# Altium project GEX_Zero.PrjPcb
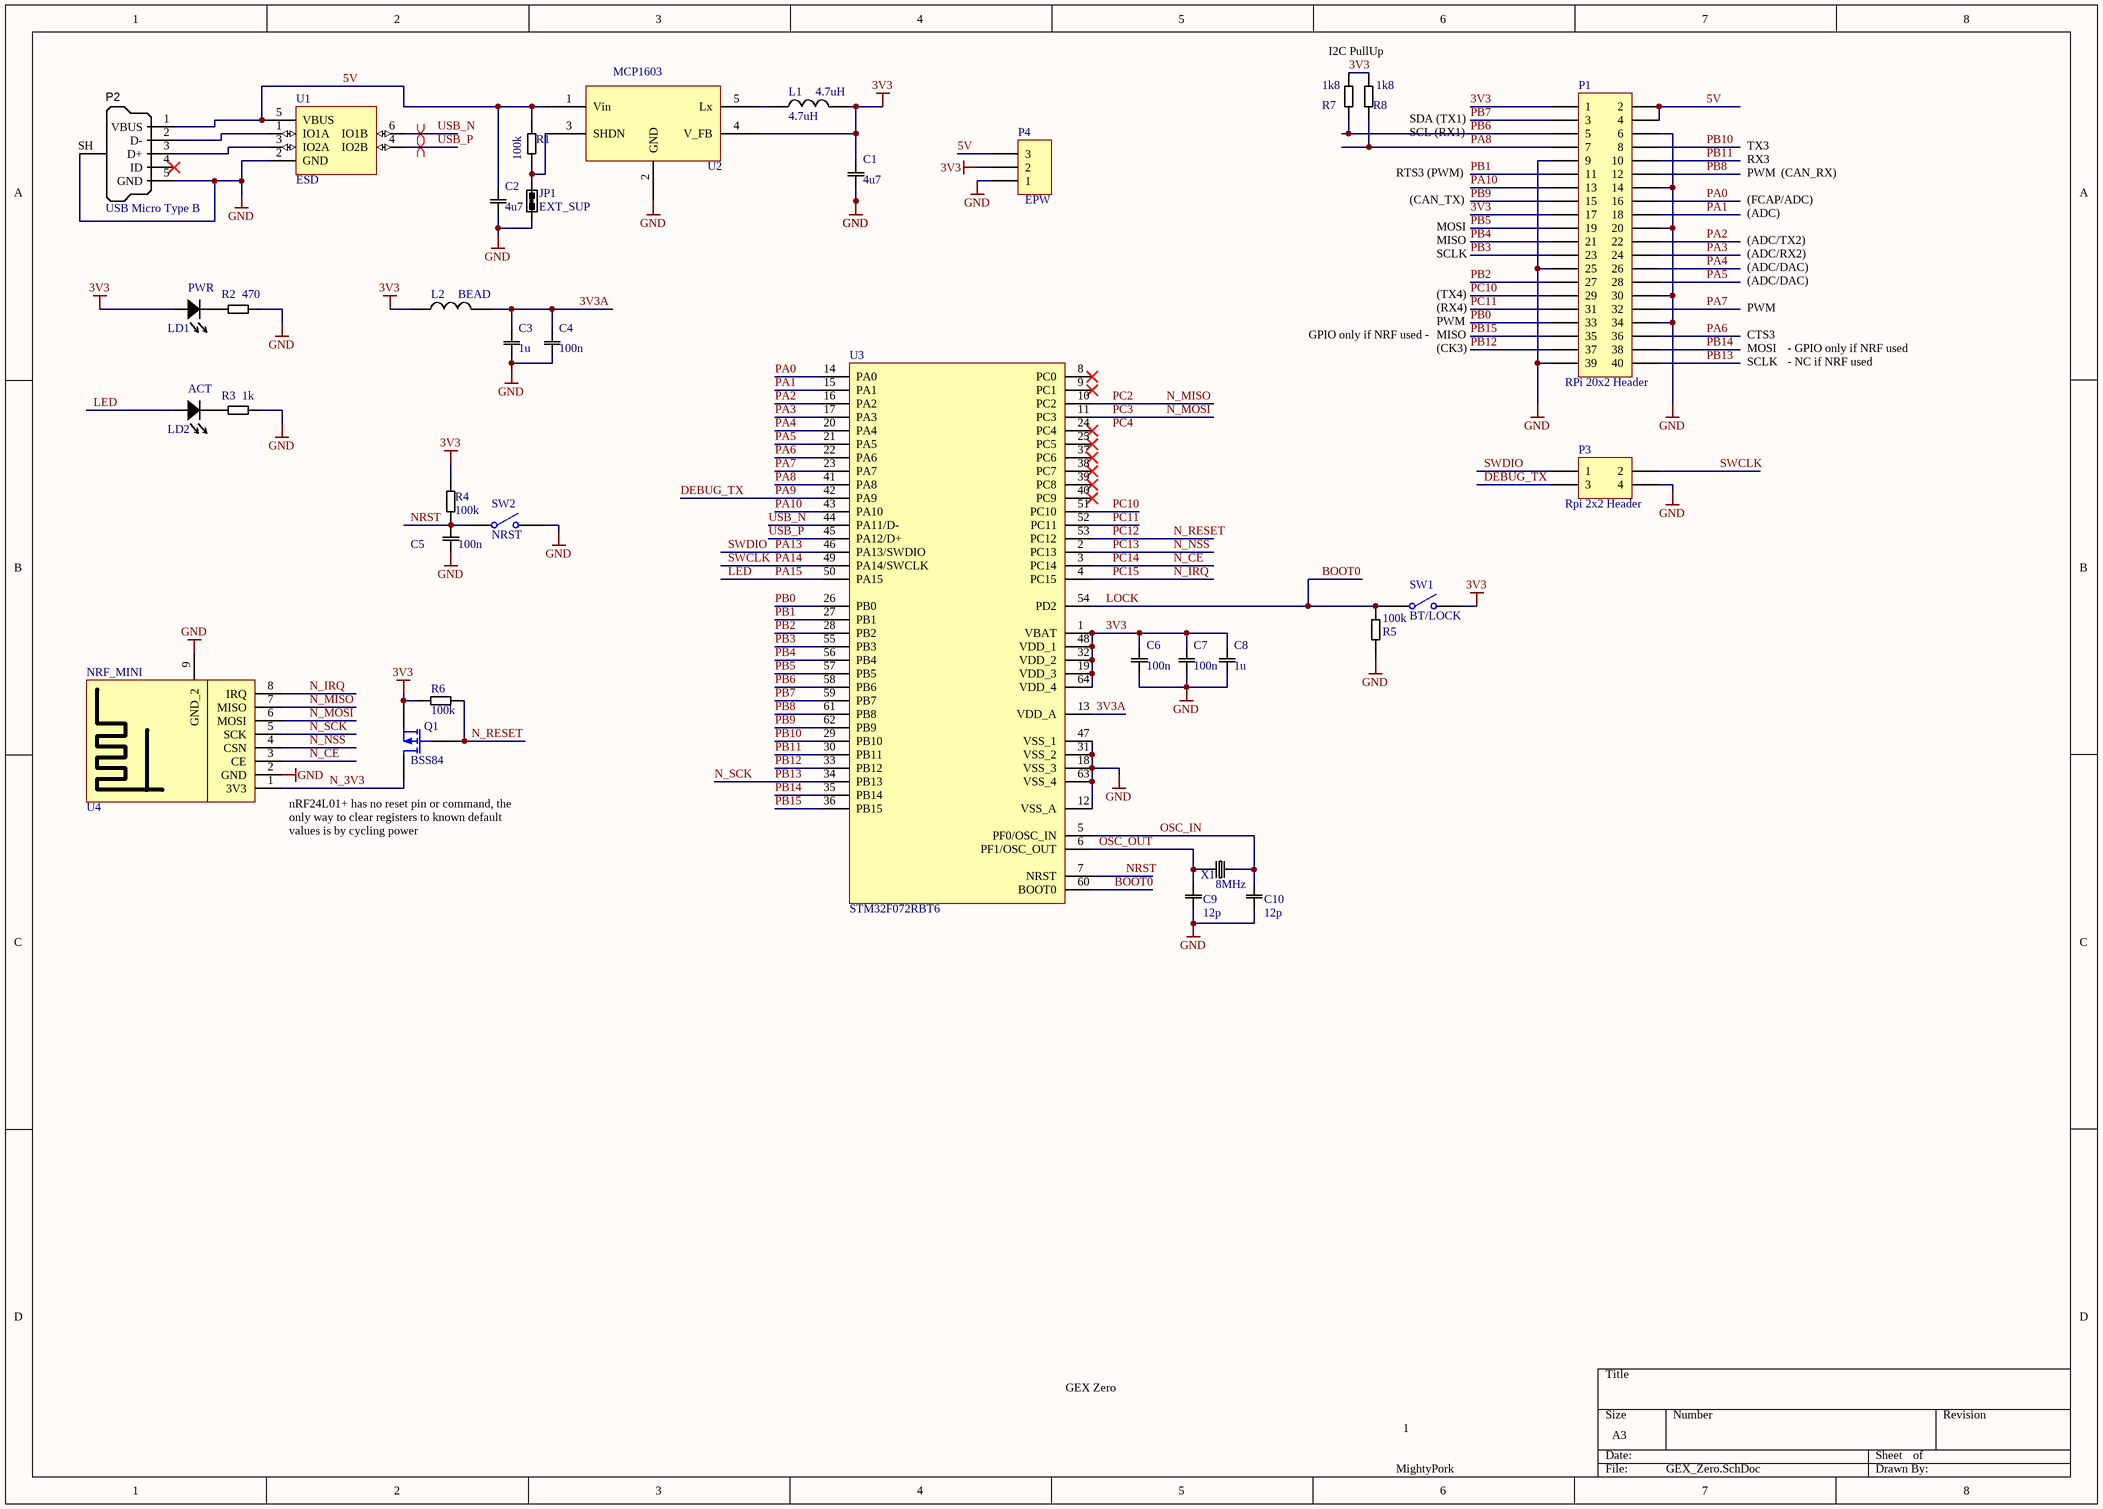
[diagram p0: GEX_Zero.SchDoc]
1 sheet, 35 parts. Net scope: global (net labels, ports and power ports of the same name join across sheets).
Board file: GEX_Zero.PcbDoc

## Sheet GEX_Zero.SchDoc: GEX Zero
size A3; Author: MightyPork; DrawnBy: MightyPork; Revision: 1

### Parts
C1  4u7  [C1206]
C2  4u7  [C1206]
C3  1u  [C0805]
C4  100n  [C0805]
C5  100n  [C0805]
C6  100n  [C0805]
C7  100n  [C0805]
C8  1u  [C0805]
C9  12p  [C0805]
C10  12p  [C0805]
JP1  EXT_SUP  [0805_SolderShort_2]
L1  4.7uH  [L_3x3]
L2  BEAD  [R0805]
LD1  PWR  [LED_SMD]
LD2  ACT  [LED_SMD]
P1  RPi 20x2 Header  [PIN_2x20]
P2  value USB Micro Type B  [USB_Micro-B_AFCI_10118194]  (hidden comment: USB_Micro_TypeB_Molex_105017)
P3  Rpi 2x2 Header  [PIN_2x2]
P4  EPW  [PIN_1x3]
Q1  BSS84  [SOT23]
R1  100k  [R0805]
R2  470  [R0805]
R3  1k  [R0805]
R4  100k  [R0805]
R5  100k  [R0805]
R6  100k  [R0805]
R7  1k8  [R0805]
R8  1k8  [R0805]
SW1  BT/LOCK  [SIDE_BTN_2-4-3.5]
SW2  NRST  [SIDE_BTN_2-4-3.5]
U1  ESD  [SOT23-6]
U2  MCP1603  [SOT23-5]
U3  STM32F072RBT6  [LQFP64]
U4  NRF_MINI  [NRF_MINI]
X1  8MHz  [XTAL-SMD-50-32]

### Nets
3V3: C1.2 C6.2 C7.2 C8.2 L1.2 L2.1 LD1.A P1.1 P1.17 P4.2 Q1.2(S) R4.1 R6.2 R7.1 R8.1 SW1.2(NO) U2.4(V_FB) U3.1(VBAT) U3.19(VDD_3) U3.32(VDD_2) U3.48(VDD_1) U3.64(VDD_4)
GND: C1.1 C2.1 C3.1 C4.1 C5.1 C6.1 C7.1 C8.1 C9.1 C10.1 JP1.2 P1.6 P1.9 P1.14 P1.20 P1.25 P1.30 P1.34 P1.39 P2.5(GND) P2.SH(Shell) P3.4 P4.1 R2.1 R3.1 R5.2 SW1.3 SW2.2(NO) SW2.3 U1.2(GND) U2.2(GND) U3.12(VSS_A) U3.18(VSS_3) U3.31(VSS_2) U3.47(VSS_1) U3.63(VSS_4) U4.2(GND) U4.9(GND_2)
3V3A: C3.2 C4.2 L2.2 U3.13(VDD_A)
5V: C2.2 P1.2 P1.4 P2.1(VBUS) P4.3 R1.1 U1.5(VBUS) U2.1(Vin)
BOOT0: R5.1 SW1.1(COMMON) U3.54(PD2) U3.60(BOOT0)  [also labelled LOCK]
DEBUG_TX: P3.3 U3.42(PA9)  [also labelled PA9]
LED: LD2.A U3.50(PA15)  [also labelled PA15]
N_3V3: Q1.3(D) U4.1(3V3)
N_CE: U3.3(PC14) U4.3(CE)  [also labelled PC14]
N_IRQ: U3.4(PC15) U4.8(IRQ)  [also labelled PC15]
N_MISO: U3.10(PC2) U4.7(MISO)  [also labelled PC2]
N_MOSI: U3.11(PC3) U4.6(MOSI)  [also labelled PC3]
N_NSS: U3.2(PC13) U4.4(CSN)  [also labelled PC13]
N_RESET: Q1.1(G) R6.1 U3.53(PC12)  [also labelled PC12]
N_SCK: P1.40 U3.34(PB13) U4.5(SCK)  [also labelled PB13]
NRST: C5.2 R4.2 SW2.1(COMMON) U3.7(NRST)
OSC_IN: C10.2 U3.5(PF0/OSC_IN) X1.2
OSC_OUT: C9.2 U3.6(PF1/OSC_OUT) X1.1
PA0: P1.16 U3.14(PA0)
PA1: P1.18 U3.15(PA1)
PA2: P1.22 U3.16(PA2)
PA3: P1.24 U3.17(PA3)
PA4: P1.26 U3.20(PA4)
PA5: P1.28 U3.21(PA5)
PA6: P1.36 U3.22(PA6)
PA7: P1.32 U3.23(PA7)
PA8: P1.7 R8.2 U3.41(PA8)
PA10: P1.13 U3.43(PA10)
PA13: P3.1 U3.46(PA13/SWDIO)  [also labelled SWDIO]
PA14: P3.2 U3.49(PA14/SWCLK)  [also labelled SWCLK]
PB0: P1.33 U3.26(PB0)
PB1: P1.11 U3.27(PB1)
PB2: P1.27 U3.28(PB2)
PB3: P1.23 U3.55(PB3)
PB4: P1.21 U3.56(PB4)
PB5: P1.19 U3.57(PB5)
PB6: P1.5 R7.2 U3.58(PB6)
PB7: P1.3 U3.59(PB7)
PB8: P1.12 U3.61(PB8)
PB9: P1.15 U3.62(PB9)
PB10: P1.8 U3.29(PB10)
PB11: P1.10 U3.30(PB11)
PB12: P1.37 U3.33(PB12)
PB14: P1.38 U3.35(PB14)
PB15: P1.35 U3.36(PB15)
PC10: P1.29 U3.51(PC10)
PC11: P1.31 U3.52(PC11)
USB_N: U1.6(IO1B) U3.44(PA11/D-)
USB_P: U1.4(IO2B) U3.45(PA12/D+)
NetJP1_1: JP1.1 R1.2 U2.3(SHDN)
NetL1_1: L1.1 U2.5(Lx)
NetLD1_C: LD1.C R2.2
NetLD2_C: LD2.C R3.2
NetP2_2: P2.2(D-) U1.1(IO1A)
NetP2_3: P2.3(D+) U1.3(IO2A)

Not connected (* = marked no-connect by the designer): P2 4(ID)*; U3 8(PC0)* 9(PC1)* 24(PC4)* 25(PC5)* 37(PC6)* 38(PC7)* 39(PC8)* 40(PC9)*

### Layout directives
differential pair: USB_N, USB_P

### Notes on the sheet
- I2C PullUp
- RTS3 (PWM)
- SDA (TX1)
- SCL (RX1)
- TX3
- RX3
- PWM
- (CAN_RX)
- (CAN_TX)
- MOSI
- MISO
- (FCAP/ADC)
- (ADC)
- (ADC/TX2)
- SCLK
- (TX4)
- (RX4)
- (ADC/DAC)
- (ADC/RX2)
- GPIO only if NRF used -
- (CK3)
- CTS3
- - NC if NRF used
- - GPIO only if NRF used
- nRF24L01+ has no reset pin or command, the only way to clear registers to known default values is by cycling power
- Labels drawn without touching a wire or pin: PC4

### Library data of the parts
C1-C10 = C: Supplier 1: Farnell
  C1 C2: Value: 4u7
  C3 C8: Value: 1u
  C4-C7: Value: 100n
  C9 C10: Supplier Part Number 1: any C0805 X7R 50V; Value: 12p
JP1 = JUMP: Value: JUMP; Supplier Part Number 1: Header 2.54mmm 2way; Supplier 1: Farnell
L1 = L: Inductor; Part number: VLS3015ET-4R7M; Value: 4.7uH
L2 = L: Inductor
LD1 LD2 = LED: Value: TBD
P1 = Header 20X2: Header, 20-Pin, Dual row; LatestRevisionDate: 17-Jul-2002; LatestRevisionNote: Re-released for DXP Platform.; Publisher: Altium Limited
P2 = USB_Micro_TypeB_Molex_105017: Connector SMD USB Micro Type B bottom mount, (recommended if hand soldering); Model: USB Micro Type B (recommended if hand soldering); Package / Case: SMD/THD mid-mount; Supplier 1: Farnell; Supplier Part Number 1: 2293836
P3 = Header 2X2: Header, 2-Pin, Dual row; LatestRevisionDate: 17-Jul-2002; LatestRevisionNote: Re-released for DXP Platform.; Publisher: Altium Limited
P4 = Header_3: Header, 3-Pin; Model: TSW-103-11-G-S; Value: Header 3; Supplier 1: Farnell; Supplier Part Number 1: 2036547; Supplier 2: GME; Supplier Part Number 2: 932-360
Q1 = BSS84: P-Channel Enhancement Mode Vertical DMOS FET; Supplier 1: Farnell; Supplier Part Number 1: 1094997; Supplier 2: GME; Supplier Part Number 2: 912-041; HelpURL: http://www.farnell.com/datasheets/1718091.pdf; Model: BSS84; Package: SOT23; Value: BSS84
R1-R8 = R: Supplier Part Number 1: any R0805 1%; Supplier 1: Farnell
  R1 R4-R6: Value: 100k
  R2: Value: 470
  R3: Value: 1k
  R7 R8: Value: 1k8
SW1 SW2 = SW_SPST_4PAD_GND
U1 = USBLC6_ESD
X1 = XTALL: Value: 8MHz